# EAGLE board collpitss (EAGLE 7.6.0), part 1 of 2
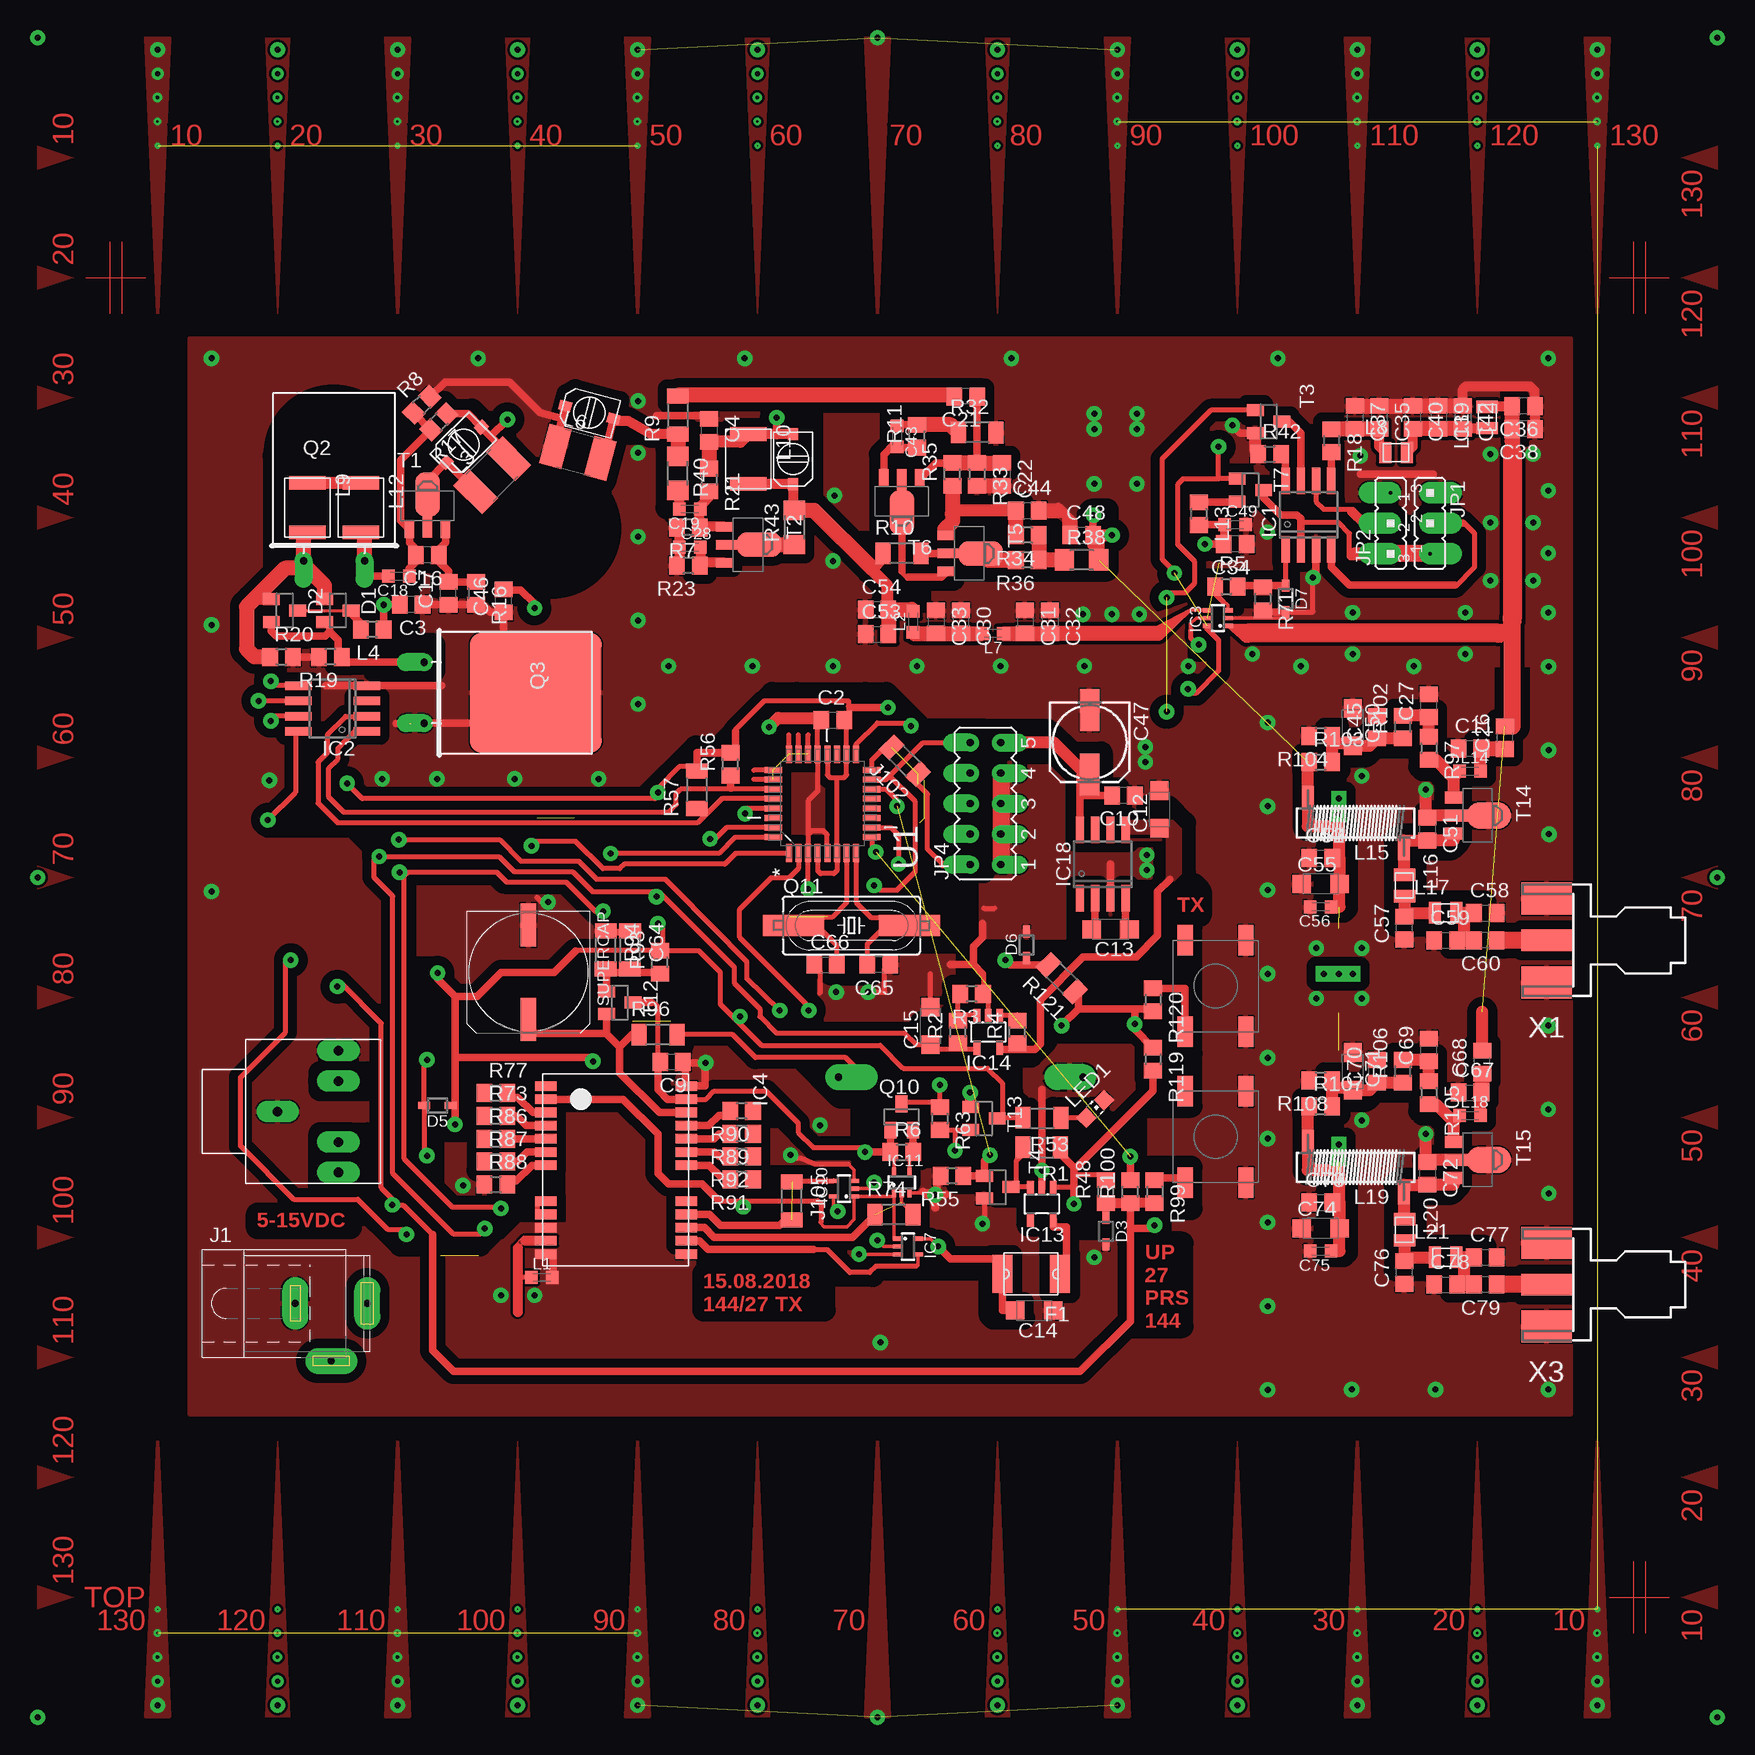
[diagram p2: board, top side]
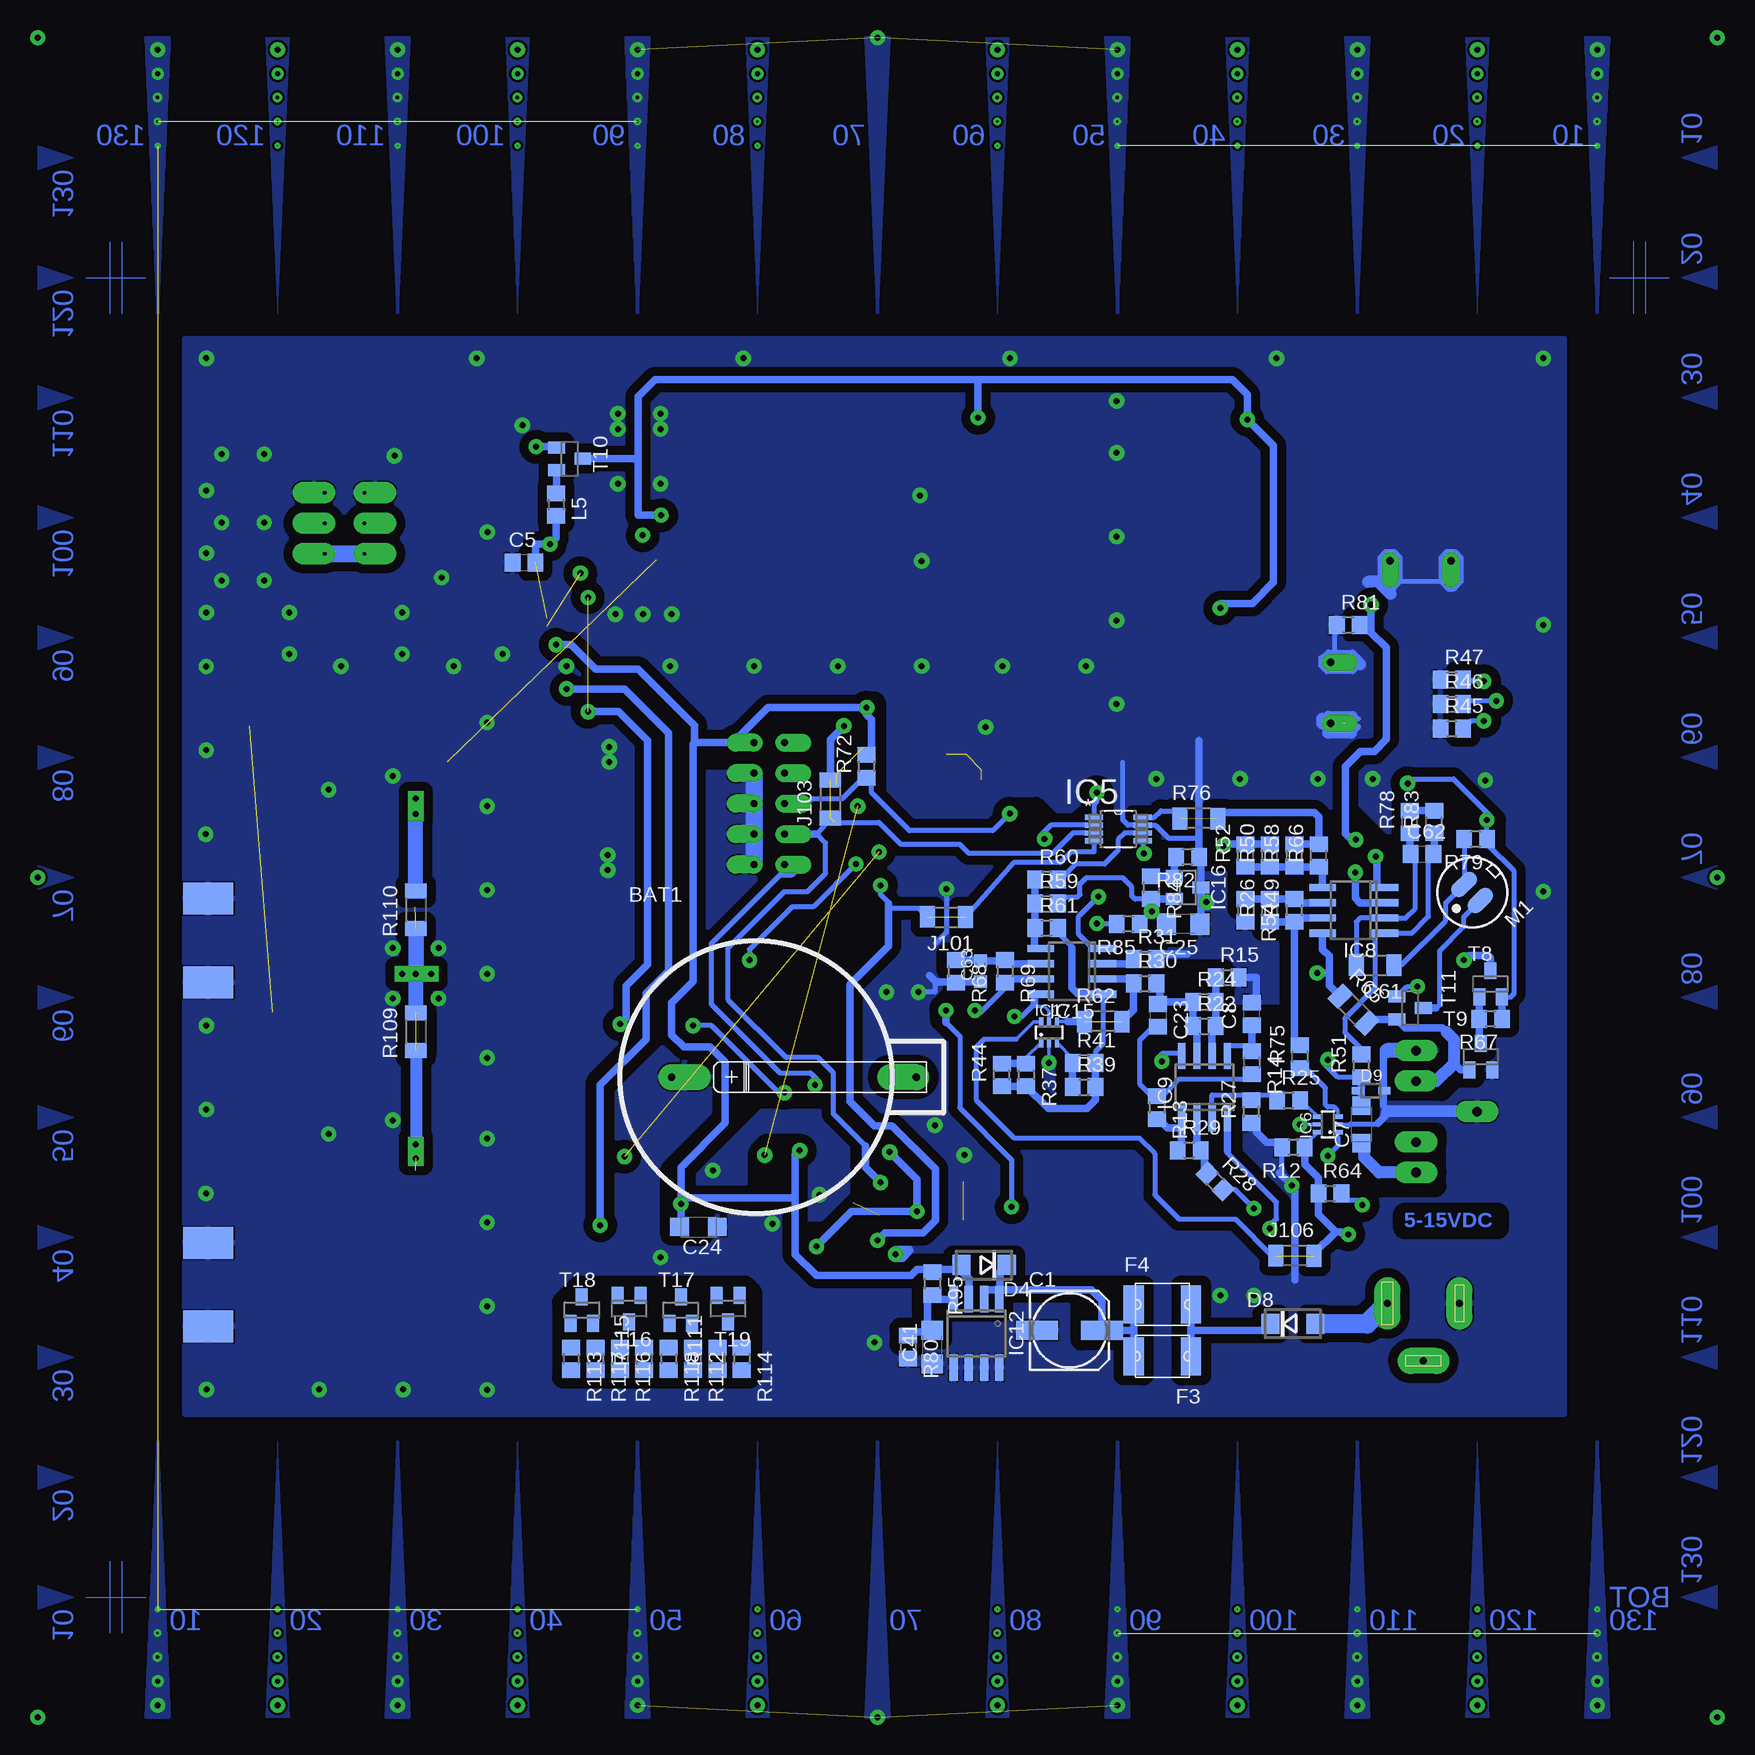
[diagram p3: board, bottom side, seen from below]

No outline drawn. Coordinates in mm, seen from the top.
Copper layers (1*16): Top 0.035mm / dielectric 1.5mm / Bottom 0.035mm
Design rules "default *": minimum track width 10mil, minimum drill 24mil, track to track 8mil, track to pad 8mil, pad to pad 8mil, via to via 8mil, smd to smd 8mil, copper to edge 40mil, drill to drill 8mil, minimum pad ring 10mil, minimum via ring 8mil, stop-mask expansion 4mil, vias tented up to drill 0mil, thermal gap 5mil
tRestrict: area 3.4,0.5 to 9,12.3; area 8.2,-14.9 to 14.1,-6.1; area 21.7,-27.6 to 26.2,-24.2; area 22.5,-19.1 to 26.2,-14.6; area -46.5,-25.7 to -42.4,-21.4; area -46.5,-17.7 to -42.3,-16.3; area -6.7,11.8 to -1,15.3; area -50.2,30.4 to -40.5,40.1; area -32,24.2 to -22.3,33.9; area -51.7,-29.2 to -43.9,-28.1; area 21,-37.5 to 25.4,-30.5; area 24.8,-3.2 to 26.9,-0.6; 207 lines
bRestrict: area -48.4,-17.7 to -42.3,-13.6; area -46.5,-25.7 to -42,-21.4; area -51.7,-29.2 to -43.9,-28.1; 107 lines

## Footprints (pad centres in the part's own frame; a part is rotated, then mirrored left to right if it is on the bottom)
CR2032_HOLDER = drill 0.6 pad 2.184 offset: + 15.4,0; - -5,0
153CLV-0605 = smd 3.5 x 1.6: + 2.7,0; - -2.7,0
C0805 = smd 1.3 x 1.5: 1 -0.95,0; 2 0.95,0
TZC3_SERIES = smd 1 x 0.85: 1 -2.075,0; 2 2.075,0
TANTAL"3216" = smd 1.55 x 1.5: + 1.575,0; - -1.575,0
C0603K = smd 1.05 x 1.08: 1 -0.875,0; 2 0.875,0
C1206 = smd 1.6 x 1.8: 1 -1.4,0; 2 1.4,0
ZWORA = smd 1.25 x 1.803: 1 -1.57,-0.01; 2 1.58,-0.02
SOT23-3 = smd 1 x 1.4: 1 -0.95,-1.1; 2 0.95,-1.1; 3 0,1.1
SOD323 = smd 1 x 0.6: A 1.1,0; C -1.1,0
DO-214AC = smd 1.52 x 1.68: A 1.88,0; C -1.88,0
1812 = smd 1.68 x 3.15: P$1 -2.39,0; P$2 2.39,0
SOIC8 = smd 0.7 x 2.2: 1 -1.905,-2.85; 2 -0.635,-2.85; 3 0.635,-2.85; 4 1.905,-2.85; 5 1.905,2.85; 6 0.635,2.85; 7 -0.635,2.85; 8 -1.905,2.85
SC70-6 = smd 0.35 x 0.8: 1 -0.65,-0.85; 2 0,-0.85; 3 0.65,-0.85; 4 0.65,0.85; 5 0,0.85; 6 -0.65,0.85
NEO-6M-0-001 = smd 0.8 x 1.8: 1 -6.6,-6.2; 2 -5.5,-6.2; 3 -4.4,-6.2; 4 -3.3,-6.2; 5 -2.2,-6.2; 6 -1.1,-6.2; 7 0,-6.2; 8 3,-6.2; 9 4.1,-6.2; 10 5.2,-6.2; 11 6.3,-6.2; 12 7.4,-6.2; 13 7.4,5.5; 14 6.3,5.5; 15 5.2,5.5; 16 4.1,5.5; 17 3,5.5; 18 0,5.5; 19 -1.1,5.5; 20 -2.2,5.5; 21 -3.3,5.5; 22 -4.4,5.5; 23 -5.5,5.5; 24 -6.6,5.5
SOP65P490X110-8N = smd 1.524 x 0.457: 1 -2.032,0.965; 2 -2.032,0.33; 3 -2.032,-0.33; 4 -2.032,-0.965; 5 2.032,-0.965; 6 2.032,-0.33; 7 2.032,0.33; 8 2.032,0.965
SC70-5 = smd 0.35 x 0.8: 1 -0.65,-0.85; 2 0,-0.85; 3 0.65,-0.85; 4 0.65,0.85; 5 -0.65,0.85
SO08 = smd 0.6 x 2.2: 1 -1.905,-2.6; 2 -0.635,-2.6; 3 0.635,-2.6; 4 1.905,-2.6; 5 1.905,2.6; 6 0.635,2.6; 7 -0.635,2.6; 8 -1.905,2.6
SOT23-5 = smd 0.55 x 1.2: 1 -0.95,-1.3; 2 0,-1.3; 3 0.95,-1.3; 4 0.95,1.3; 5 -0.95,1.3
SPC4078 = drill 0.6 pad 2.184 long: 1 -3,0; 2 0,-4.8; 3 3,0
JP2 = drill 0.3 pad 1.778 offset: 1 -2.54,0; 2 0,0; 3 2.54,0
JP5Q = drill 0.6 pad 1.5 offset: 1 -5.08,-1.27; 2 -5.08,1.27; 3 -2.54,-1.27; 4 -2.54,1.27; 5 0,-1.27; 6 0,1.27; 7 2.54,-1.27; 8 2.54,1.27; 9 5.08,-1.27; 10 5.08,1.27
0603K = smd 1.05 x 1.08: 1 -0.875,0; 2 0.875,0
L1812 = smd 1.9 x 3.4: 1 -1.95,0; 2 1.95,0
0806 = smd 1.3 x 1.5: 1 -0.95,0; 2 0.95,0
0805 = smd 1.02 x 1.78: 1 -0.89,0; 2 0.89,0
1812' = smd 1.14 x 3.05: 1 -2.07,0; 2 2.07,0
SM-Z15 = smd 1 x 2: 1 -4,2.1; 2 4,-2.1
CHIP-LED0805 = smd 1.2 x 1.2: A 0,-1.05; C 0,1.05
WM-61A = smd 2.5 x 1.3: 1 0,0.95; 2 0,-0.95
Q" = drill 0.6 pad 1.5 offset: 1 -2.54,-8.89; 2 2.54,-8.89
Q = drill 0.6 pad 1.5 offset: 1 -2.54,-7.62; 2 2.54,-7.62 | smd 10 x 11: P$1 0,1.7
SM49 = smd 5.08 x 1.778: 1 -4.826,0; 2 4.826,0
R0805 = smd 1.3 x 1.5: 1 -0.95,0; 2 0.95,0
R1206 = smd 1.6 x 1.803: 1 -1.422,0; 2 1.422,0
UD-10X10_NICHICON = smd 3.6 x 1.3: + 3.925,0; - -3.95,0
TACT = smd 1.27 x 2.54: 1 -2.54,-3.81; 2 2.54,-3.81; 3 2.54,3.81; 4 -2.54,3.81
SOT-89-BCE = smd 0.8 x 1.4: B -1.499,-1.981; E 1.499,-1.981 | smd 0.8 x 1.9: C 0,-1.727 | smd 2.032 x 3.65: C@1 0,0.94
SOT23-3W = smd 1 x 1.4: 1 -0.95,-1.1; 2 0.95,-1.1; 3 0,1.1
SOT23 = smd 1 x 1.4: 1 -0.95,-1.1; 2 0.95,-1.1; 3 0,1.1
SOT-89-GSD = smd 1 x 1.5: 1 -1.499,-1.981; 3 1.499,-1.981 | smd 1 x 2: 2 0,-1.727 | smd 2.2 x 3.7: 2@1 0,0.94
QFP80P900X900X120-32N = smd 1.473 x 0.508: 1 -4.115,2.794; 2 -4.115,2.007; 3 -4.115,1.194; 4 -4.115,0.406; 5 -4.115,-0.406; 6 -4.115,-1.194; 7 -4.115,-2.007; 8 -4.115,-2.794; 17 4.115,-2.794; 18 4.115,-2.007; 19 4.115,-1.194; 20 4.115,-0.406; 21 4.115,0.406; 22 4.115,1.194; 23 4.115,2.007; 24 4.115,2.794 | smd 0.508 x 1.473: 9 -2.794,-4.115; 10 -2.007,-4.115; 11 -1.194,-4.115; 12 -0.406,-4.115; 13 0.406,-4.115; 14 1.194,-4.115; 15 2.007,-4.115; 16 2.794,-4.115; 25 2.794,4.115; 26 2.007,4.115; 27 1.194,4.115; 28 0.406,4.115; 29 -0.406,4.115; 30 -1.194,4.115; 31 -2.007,4.115; 32 -2.794,4.115
J502-ND-142-0711-821/826 = smd 4.191 x 1.778: 1 2.115,0 | smd 4.191 x 2.667: G@1 2.115,3.495; G@2 2.115,-3.495 | smd 4.191 x 2.667 bottom: G@3 2.115,3.495; G@4 2.115,-3.495
JACK_SOCKET = drill 0.8 pad 1.778 long: G 0,2.41; L -5.08,-2.67; LC -2.54,-2.67; R 5.08,-2.67; RC 2.54,-2.67

## Placement (x,y rotation side)
BAT1  CR2032  [CR2032_HOLDER]  12.16,-16.65 0 bottom
C1  100uF  [153CLV-0605]  -16.01,-37.76 0 bottom
C2  100n  [C0805]  -3.72,13.11 0 top
C3  100n  [C0805]  -38.85,22.73 180 top
C4  100n  [C0805]  -14.02,37.25 270 top
C5  100n  [C0805]  29.46,26.25 0 bottom
C6  10p  [TZC3_SERIES]  -34.49,36.06 45 top
C7  4u7/16V  [TANTAL"3216"]  -40.35,-20.6 90 bottom
C8  10n  [C0805]  -31.2,-11.39 90 bottom
C9  100n  [C0805]  -17.15,-15.41 180 top
C10  100n  [C0805]  20.52,6.83 180 top
C11  27p  [C0805]  49.4,10.76 0 top
C12  10u/16V  [TANTAL"3216"]  23.51,5.66 90 top
C13  10u/16V  [TANTAL"3216"]  19.44,-4.33 180 top
C14  10u/16V  [TANTAL"3216"]  13.07,-36.11 180 top
C15  4u7/16V  [TANTAL"3216"]  4.42,-12.38 90 top
C16  66p  [C0805]  -37.5,26.85 180 top
C17  100p  [C0805]  -35.76,23.68 90 top
C18  1n  [C0603K]  -39.89,25.11 180 top
C19  1n  [C0603K]  -15.63,30.7 180 top
C20  10p  [TZC3_SERIES]  -24.01,38.76 345 top
C21  100n  [C0805]  7.36,40.09 180 top
C22  100n  [C0805]  10.38,33.6 270 top
C23  10n  [C0805]  -23.38,-11.5 270 bottom
C24  10u/16V  [TANTAL"3216"]  14.92,-29.15 180 bottom
C25  1u  [C1206]  -25.49,-3.9 180 bottom
C26  100p  [C0805]  52.32,11.65 90 top
C27  100p  [C0805]  45.97,14.31 90 top
C28  1n  [C0603K]  -15.63,27.52 0 top
C29  10p  [TZC3_SERIES]  -7.04,34.87 90 top
C30  220p  [C0805]  6.95,21.3 270 top
C31  100p  [C0805]  12.32,21.3 270 top
C32  30.6p  [C0805]  14.38,21.3 270 top
C33  4.9p  [C0805]  4.89,21.3 270 top
C34  100n  [C0805]  29.83,27.77 180 top
C35  22p  [C0805]  41.82,38.34 270 top
C36  22p  [C0805]  53.86,39.29 180 top
C37  9.8p  [C0805]  39.79,38.34 270 top
C38  9.8p  [C0805]  53.86,37.38 180 top
C39  15p  [C0805]  46.78,38.34 270 top
C40  21.4p  [C0805]  44.62,38.34 270 top
C41  1u  [C1206]  -4.58,-39.15 90 bottom
C42  15p  [C0805]  48.81,38.34 270 top
C43  1n  [C0603K]  1.64,36.78 270 top
C44  100n  [C0805]  12.5,30.58 0 top
C45  100p  [C0805]  41.65,12.53 90 top
C46  100n  [C0805]  -31.15,23.04 90 top
C47  100uF  [153CLV-0605]  17.7,11.26 270 top
C48  100n  [C0805]  17.03,28.52 0 top
C49  1n  [C0603K]  29.83,29.39 0 top
C50  1u/16V  [TANTAL"3216"]  39.62,12.53 270 top
C51  18p  [C0805]  45.84,4.03 270 top
C52  100p  [C0805]  36.95,1.61 0 top
C53  100p  [C0805]  -0.03,20.27 0 top
C54  30.6p  [C0805]  -0.03,22.33 0 top
C55  1u/16V  [TANTAL"3216"]  36.95,-0.55 0 top
C56  1n  [C0603K]  36.95,-2.45 180 top
C57  22p  [C0805]  43.93,-4.23 90 top
C58  100p  [C0805]  50.67,-2.96 0 top
C59  56p  [C0805]  47.36,-5.25 0 top
C60  100p  [C0805]  50.67,-5.25 180 top
C61  1u  [ZWORA]  -41.49,-7.33 180 bottom
C62  15p  [C0805]  -45.39,1.95 0 bottom
C63  1n  [C0603K]  -8.6,-7.83 90 bottom
C64  1u  [ZWORA]  -20.61,-6.06 270 top
C65  15  [C0805]  0.12,-7.28 180 top
C66  15p  [C0805]  -4.33,-7.28 0 top
C67  27p  [C0805]  49.4,-17.95 0 top
C68  100p  [C0805]  50.41,-15.41 90 top
C69  100p  [C0805]  45.97,-14.39 90 top
C70  100p  [C0805]  41.65,-16.17 90 top
C71  1u/16V  [TANTAL"3216"]  39.62,-16.17 270 top
C72  18p  [C0805]  45.84,-24.68 270 top
C73  100p  [C0805]  36.95,-27.09 0 top
C74  1u/16V  [TANTAL"3216"]  36.95,-29.25 0 top
C75  1n  [C0603K]  36.95,-31.15 180 top
C76  22p  [C0805]  43.93,-32.93 90 top
C77  100p  [C0805]  50.67,-31.66 0 top
C78  56p  [C0805]  47.36,-33.95 0 top
C79  100p  [C0805]  50.67,-33.95 180 top
D1  BBY66-05  [SOT23-3]  -44.97,22.25 270 top
D2  BBY66-05  [SOT23-3]  -49.41,22.25 270 top
D3  5V1  [SOD323]  19.04,-29.5 270 top
D4  1N4001  [DO-214AC]  -8.9,-32.3 180 bottom
D5  5V1  [SOD323]  -36.66,-19.01 180 top
D6  5V1  [SOD323]  12.44,-5.63 90 top
D7  5V1  [SOD323]  34.03,23.22 270 top
D8  1N5819  [DO-214AC]  -34.63,-37.22 0 bottom
D9  5V1  [SOD323]  -41.15,-17.78 0 bottom
F1  SMDC020F  [1812]  12.82,-33.06 180 top
F3  SMDC020F  [1812]  -23.76,-39.92 180 bottom
F4  SMDC020F  [1812]  -23.76,-35.6 0 bottom
IC1  ICS511  [SOIC8]  35.93,30.21 0 top
IC2  DS1624  [SOIC8]  -45.41,14.07 90 top
IC3  SN74LVC1G3157  [SC70-6]  28.37,21.61 90 top
IC4  NEO-6M-0-001  [NEO-6M-0-001]  -21.42,-23.99 270 top
IC5  MCP4822-E/MS  [SOP65P490X110-8N]  -20.09,4.03 0 bottom
IC6  SN74LVC1G3157  [SC70-6]  -37.55,-20.6 90 bottom
IC7  NC7SZ125  [SC70-5]  2.53,-30.77 270 top
IC8  TS922  [SO08]  -39.71,-2.75 90 bottom
IC9  TS922  [SO08]  -27.26,-17.49 0 bottom
IC10  NC7SZ125  [SC70-5]  -2.8,-25.95 90 top
IC11  NC7SZ125  [SC70-5]  2.02,-25.44 0 top
IC12  MIC5209  [SOIC8]  -8.26,-38.01 180 bottom
IC13  TLV702  [SOT23-5]  13.71,-27.22 180 top
IC14  MIC5271  [SOT23-5]  9.25,-12.89 180 top
IC15  TS922  [SO08]  -16.22,-7.83 90 bottom
IC16  TLV431  [SOT23-3]  -25.87,-0.85 270 bottom
IC17  SN74LVC1G3157  [SC70-6]  -14.31,-12.91 0 bottom
IC18  TC1044SEOA  [SOIC8]  18.79,1.1 0 top
J1  [SPC4078]  -45.52,-35.5 0 top
J101  [ZWORA]  -5.75,-3.31 180 bottom
J102  [ZWORA]  2.29,9.71 135 top
J103  [ZWORA]  3.94,6.53 90 bottom
J105  [ZWORA]  -7.12,-26.96 270 top
J106  [ZWORA]  -34.81,-31.53 0 bottom
JP1  [JP2]  46.07,29.52 270 top
JP2  [JP2]  42.77,29.52 90 top
JP4  [JP5Q]  9.02,6.15 90 top
L1  390nH  [0603K]  -27.96,-33.34 0 top
L2  390nH  [0603K]  2.98,21.3 90 top
L3  5u3  [L1812]  -32.11,33.52 45 top
L4  dlawik  [0806]  -42.11,20.66 180 top
L5  dlawik  [0806]  26.79,31.08 270 bottom
L6  5u3  [L1812]  -24.96,35.43 345 top
L7  390nH  [0603K]  9.64,20.33 180 top
L8  68nH  [0805]  43.24,35.4 0 top
L9  6u8  [1812']  -47.51,30.82 270 top
L10  6u8  [1812']  -10.77,34.87 270 top
L11  68nH  [0805]  50.82,38.34 90 top
L12  6u8  [1812']  -43.06,30.82 270 top
L13  dlawik  [0806]  26.79,30.31 270 top
L14  33nH  [0603K]  49.4,8.85 0 top
L15  8T;D0.5;fi2.4  [SM-Z15]  39.87,4.53 180 top
L16  3.6nH  [0805]  43.93,-0.67 270 top
L17  7.5nH  [0805]  47.36,-2.96 0 top
L18  33nH  [0603K]  49.4,-19.85 0 top
L19  8T;D0.5;fi2.4  [SM-Z15]  39.87,-24.17 180 top
L20  3.6nH  [0805]  43.93,-29.38 270 top
L21  7.5nH  [0805]  47.36,-31.66 0 top
LED1  green  [CHIP-LED0805]  18.16,-19.3 315 top
M1  ELECTRET_MICROPHON-WM-61A  [WM-61A]  -49.58,-1.26 225 bottom
Q2  [Q"]  -45.28,35.27 0 top
Q3  XTAL_RIGHT_GND  [Q]  -30.17,15.39 270 top
Q10  [SOT23-3]  2.02,-19.98 0 top
Q11  8..16M  [SM49]  -2.16,-4.01 0 top
R1  680k  [ZWORA]  13.71,-22.52 180 top
R2  33k  [R0805]  6.71,-12.89 90 top
R3  12k  [R0805]  7.85,-9.71 180 top
R4  680k  [R0805]  11.66,-12.89 90 top
R5  100R  [R0805]  29.1,24.25 0 top
R6  4k7  [R0805]  2.02,-22.9 0 top
R7  placeholder  [R0805]  -15.76,29.17 180 top
R8  placeholder  [R0805]  -37.98,39.39 45 top
R9  [ZWORA]  -16.64,38.52 90 top
R10  [ZWORA]  2.04,27.03 0 top
R11  510R  [R0805]  3.31,36.78 90 top
R12  330k  [R0805]  -34.68,-22.52 180 bottom
R13  3k9  [R0805]  -23.3,-19.2 270 bottom
R14  3k9  [R0805]  -31.2,-15.45 270 bottom
R15  20k  [R0805]  -29.17,-8.34 0 bottom
R16  470R  [R0805]  -33.46,23.68 270 top
R17  33k  [R0805]  -36.55,37.97 225 top
R18  33R  [R0805]  37.85,36.4 270 top
R19  68k  [R0805]  -45.6,18.38 180 top
R20  68k  [R0805]  -49.66,18.38 0 top
R21  22k  [R0805]  -14.02,33.12 270 top
R22  12k  [R0805]  -27.26,-12.41 0 bottom
R23  180R  [R0805]  -15.76,26 180 top
R24  [R0805]  -27.26,-10.37 0 bottom
R25  10k  [R0805]  -34.28,-18.58 0 bottom
R26  [R0805]  -32.73,-2.75 90 bottom
R27  10k  [R0805]  -31.17,-19.52 90 bottom
R28  10k  [R0805]  -28.15,-25.36 315 bottom
R29  10k  [R0805]  -25.99,-22.74 0 bottom
R30  22k  [R0805]  -22.31,-8.85 0 bottom
R31  1k  [R0805]  -22.31,-6.82 0 bottom
R32  68R  [ZWORA]  8.31,37.09 0 top
R33  68k  [R0805]  8.31,33.6 270 top
R34  100k  [R0805]  12.5,28.52 180 top
R35  68k  [R0805]  6.25,33.6 90 top
R36  6k8  [R0805]  12.5,26.46 180 top
R37  33k  [R0805]  -12.41,-16.47 270 bottom
R38  0R  [R1206]  17.03,26.46 0 top
R39  1k  [R0805]  -17.23,-17.49 0 bottom
R40  0R  [R1206]  -16.64,33.68 270 top
R41  [R0805]  -17.23,-15.45 0 bottom
R42  BK  [R0805]  32.7,35.29 0 top
R43  0R  [R1206]  -6.91,29.17 90 top
R44  220k  [R0805]  -10.37,-16.47 90 bottom
R45  [R0805]  -47.89,12.41 0 bottom
R46  [R0805]  -47.89,14.44 0 bottom
R47  [R0805]  -47.89,16.47 0 bottom
R48  68k  [R0805]  19.04,-26.2 90 top
R49  8k2  [R0805]  -34.76,-2.75 90 bottom
R50  47k  [R0805]  -32.73,1.82 90 bottom
R51  510R  [R0805]  -40.35,-15.71 90 bottom
R52  4M7  [R0805]  -30.69,1.82 90 bottom
R53  680R  [ZWORA]  13.72,-20.07 180 top
R54  47k  [R0805]  -30.69,-2.75 270 bottom
R55  100k  [R0805]  6.22,-24.89 180 top
R56  4k7  [R0805]  -12.25,9.44 90 top
R57  4k7  [ZWORA]  -15.06,7.3 90 top
R58  120k  [R0805]  -34.76,1.82 90 bottom
R59  27k  [R0805]  -14.1,-2.2 0 bottom
R60  27k  [R0805]  -14.1,-0.17 0 bottom
R61  27k  [R0805]  -14.1,-4.23 0 bottom
R62  0R  [ZWORA]  -18.82,-12.01 0 bottom
R63  10k  [R0805]  5.2,-20.1 270 top
R64  33k  [R0805]  -37.73,-26.34 0 bottom
R65  100k  [ZWORA]  -39.71,-11.01 315 bottom
R66  8k2  [R0805]  -36.79,1.82 90 bottom
R67  100k  [R0805]  -51.11,-11.8 180 bottom
R68  10k  [R0805]  -6.56,-7.83 270 bottom
R69  20k  [R0805]  -10.63,-7.83 270 bottom
R71  1k  [R0805]  32.12,23.22 270 top
R72  10k  [R0805]  0.89,9.26 90 bottom
R73  [R0805]  -31.8,-19.88 0 top
R74  [ZWORA]  1.39,-28.11 0 top
R75  510R  [R0805]  -35.23,-14.95 90 bottom
R76  0R  [ZWORA]  -26.8,4.91 0 bottom
R77  [R0805]  -31.8,-17.98 0 top
R78  47k  [R0805]  -44.38,4.61 90 bottom
R79  10k  [R0805]  -49.87,3.18 180 bottom
R80  33k  [R0805]  -2.55,-39.15 270 bottom
R81  100R  [R0805]  -39.25,21.04 0 bottom
R82  10k  [R0805]  -25.87,1.69 180 bottom
R83  47k  [R0805]  -46.41,4.61 90 bottom
R84  10k  [R0805]  -22.82,-0.85 270 bottom
R85  5k6  [R0805]  -20.91,-3.9 180 bottom
R86  [R0805]  -31.8,-21.79 0 top
R87  [R0805]  -31.8,-23.69 0 top
R88  0R  [R0805]  -31.8,-25.6 0 top
R89  [R0805]  -11.31,-21.37 180 top
R90  [R0805]  -11.31,-19.47 180 top
R91  [R0805]  -11.31,-25.18 180 top
R92  [R0805]  -11.31,-23.28 180 top
R93  100k  [R0805]  -18.13,-7.07 90 top
R94  270k  [ZWORA]  -22.64,-6.06 270 top
R95  100k  [R0805]  -4.58,-33.87 270 bottom
R96  470R  [ZWORA]  -18.29,-13.09 0 top
R97  33R  [R0805]  45.97,10.76 270 top
R99  4k7  [R0805]  23.11,-26.2 270 top
R100  1k  [R0805]  21.07,-26.2 90 top
R102  1k  [R0805]  43.81,12.53 90 top
R103  390R  [R0805]  36.95,9.61 0 top
R104  1k  [R0805]  36.95,11.77 180 top
R105  33R  [R0805]  45.97,-17.95 270 top
R106  1k  [R0805]  43.81,-16.17 90 top
R107  390R  [R0805]  36.95,-19.09 0 top
R108  1k  [R0805]  36.95,-16.93 180 top
R109  0R  [ZWORA]  38.47,-12.87 90 bottom
R110  0R  [ZWORA]  38.47,-2.71 90 bottom
R111  390R  [R0805]  13.34,-40.13 90 bottom
R112  390R  [R0805]  15.37,-40.13 270 bottom
R113  390R  [R0805]  25.53,-40.13 270 bottom
R114  390R  [R0805]  11.3,-40.13 270 bottom
R115  390R  [R0805]  19.43,-40.13 90 bottom
R116  390R  [R0805]  21.46,-40.13 270 bottom
R117  390R  [R0805]  23.5,-40.13 270 bottom
R118  390R  [R0805]  17.4,-40.13 270 bottom
R119  68k  [R0805]  22.98,-15.15 270 top
R120  4k7  [R0805]  22.98,-10.2 270 top
R121  1k  [ZWORA]  15.36,-8.42 135 top
SUPERCAP  100mF/5V  [UD-10X10_NICHICON]  -29.09,-7.91 270 top
SW1  TACT  [TACT]  28.19,-21.63 0 top
SW2  TACT  [TACT]  28.19,-9.06 0 top
T1  2SC3357  [SOT-89-BCE]  -37.5,30.98 0 top
T2  2SC3357  [SOT-89-BCE]  -10.77,27.73 270 top
T3  2N7002  [SOT23-3W]  32.62,37.99 270 top
T4  2N7002  [SOT23-3W]  10.03,-25.82 270 top
T5  2SC3357  [SOT-89-BCE]  7.68,27 270 top
T6  2SC3357  [SOT-89-BCE]  2.04,31.35 180 top
T7  DMP3130L  [SOT23-3]  31.09,32.27 270 top
T8  DMP3130L  [SOT23-3]  -51.11,-8.88 0 bottom
T9  2N7002  [SOT23-3W]  -50.3,-14.95 0 bottom
T10  DMP3130L  [SOT23-3]  25.65,34.89 270 bottom
T11  2N7002  [SOT23-3W]  -44.41,-10.88 270 bottom
T12  BC847ASMD  [SOT23]  -21.47,-10.45 270 top
T13  DMP3130L  [SOT23-3]  8.88,-20.1 270 top
T14  RQA0009SXAQS  [SOT-89-GSD]  50.03,5.17 270 top
T15  RQA0009SXAQS  [SOT-89-GSD]  50.03,-23.53 270 top
T16  DMP3130L  [SOT23-3]  20.7,-35.94 180 bottom
T17  DMP3130L  [SOT23-3]  16.38,-36.07 0 bottom
T18  DMP3130L  [SOT23-3]  24.64,-36.07 0 bottom
T19  DMP3130L  [SOT23-3]  12.45,-35.94 180 bottom
U1  ATMEGA328P-AU  [QFP80P900X900X120-32N]  -4.57,6.15 90 top
X1  SMA-142-0711-821/826  [J502-ND-142-0711-821/826]  57.9,-5.25 180 top
X2  JACK_SOCKET  [JACK_SOCKET]  -47.58,-19.52 90 top
X3  SMA-142-0711-821/826  [J502-ND-142-0711-821/826]  57.9,-33.95 180 top